# Altium schematic sheet CM4_MotherBoard.SchDoc
size A0
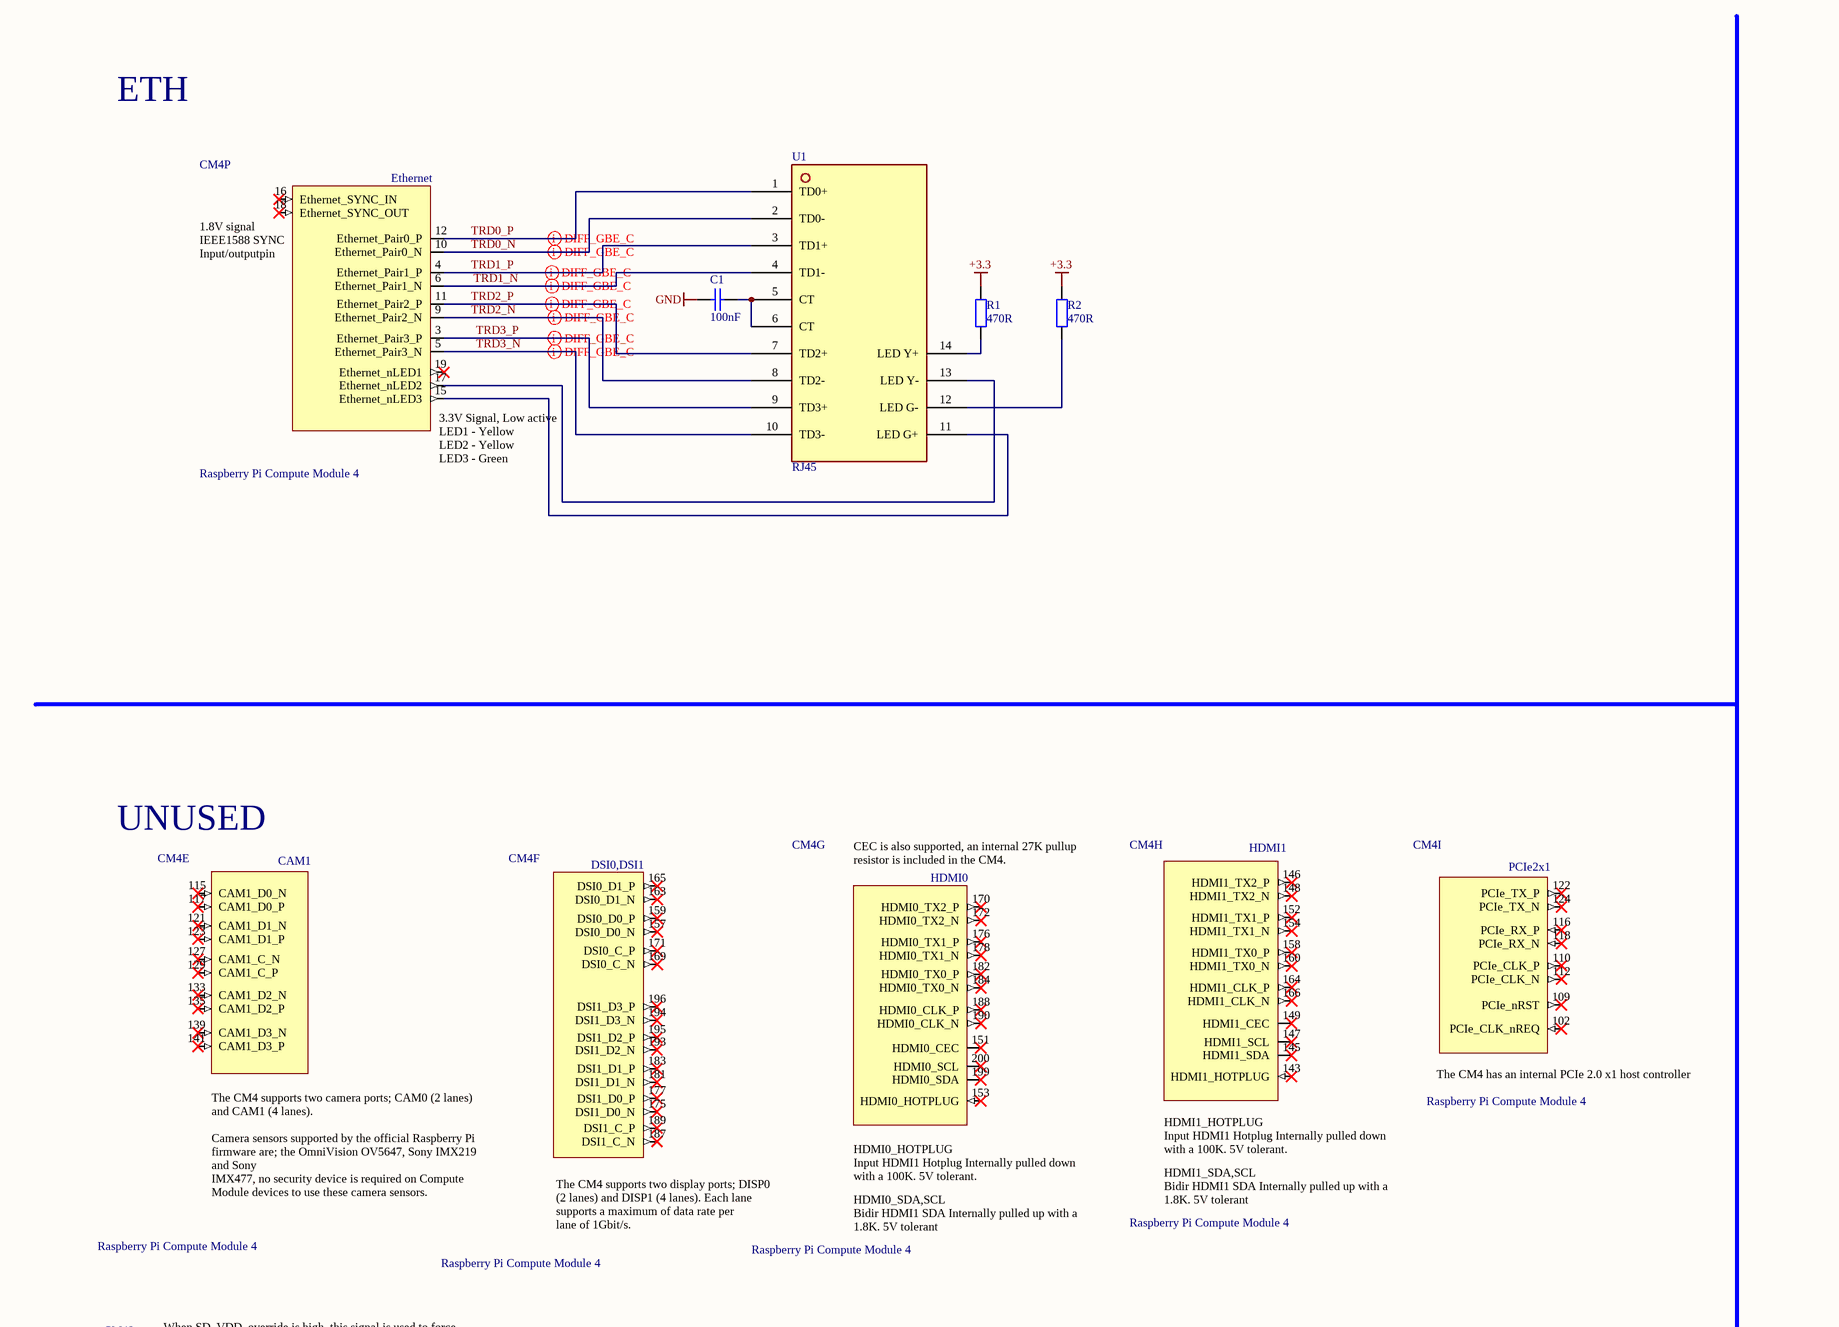
[diagram p0: CM4_MotherBoard.SchDoc, top left]
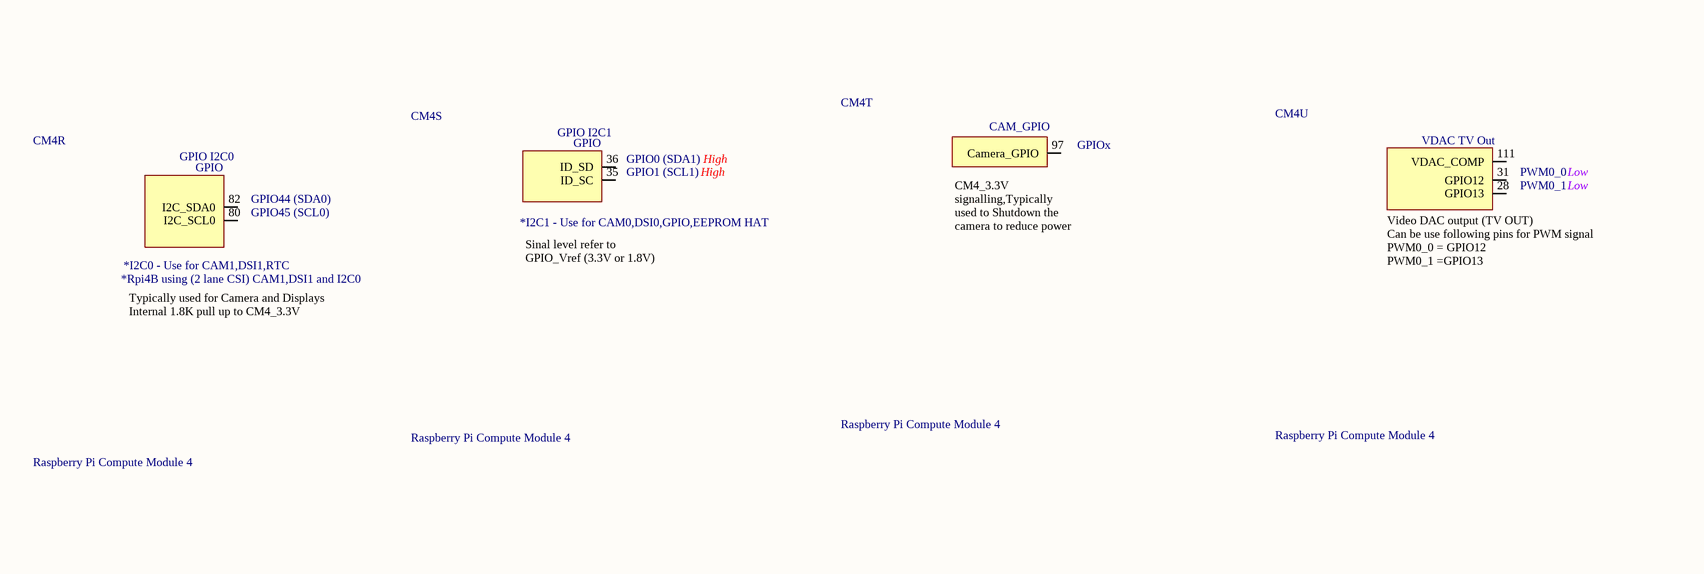
[diagram p1: CM4_MotherBoard.SchDoc, top middle]
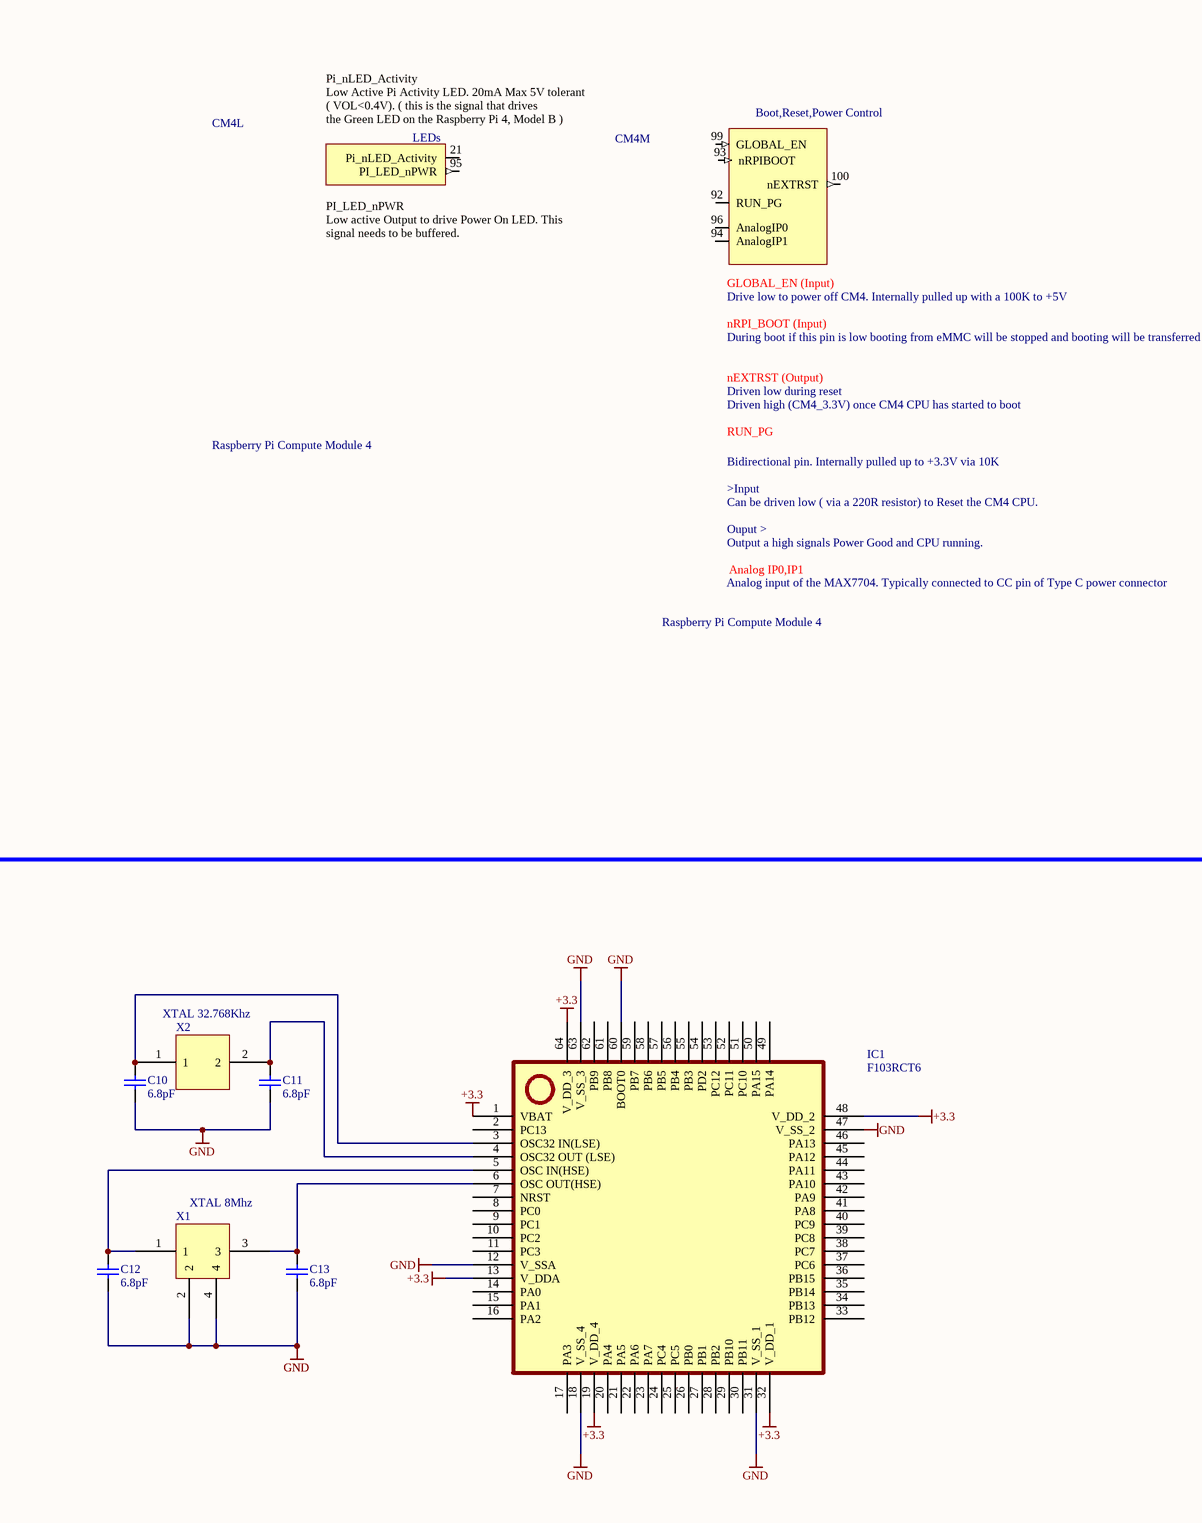
[diagram p2: CM4_MotherBoard.SchDoc, top right]
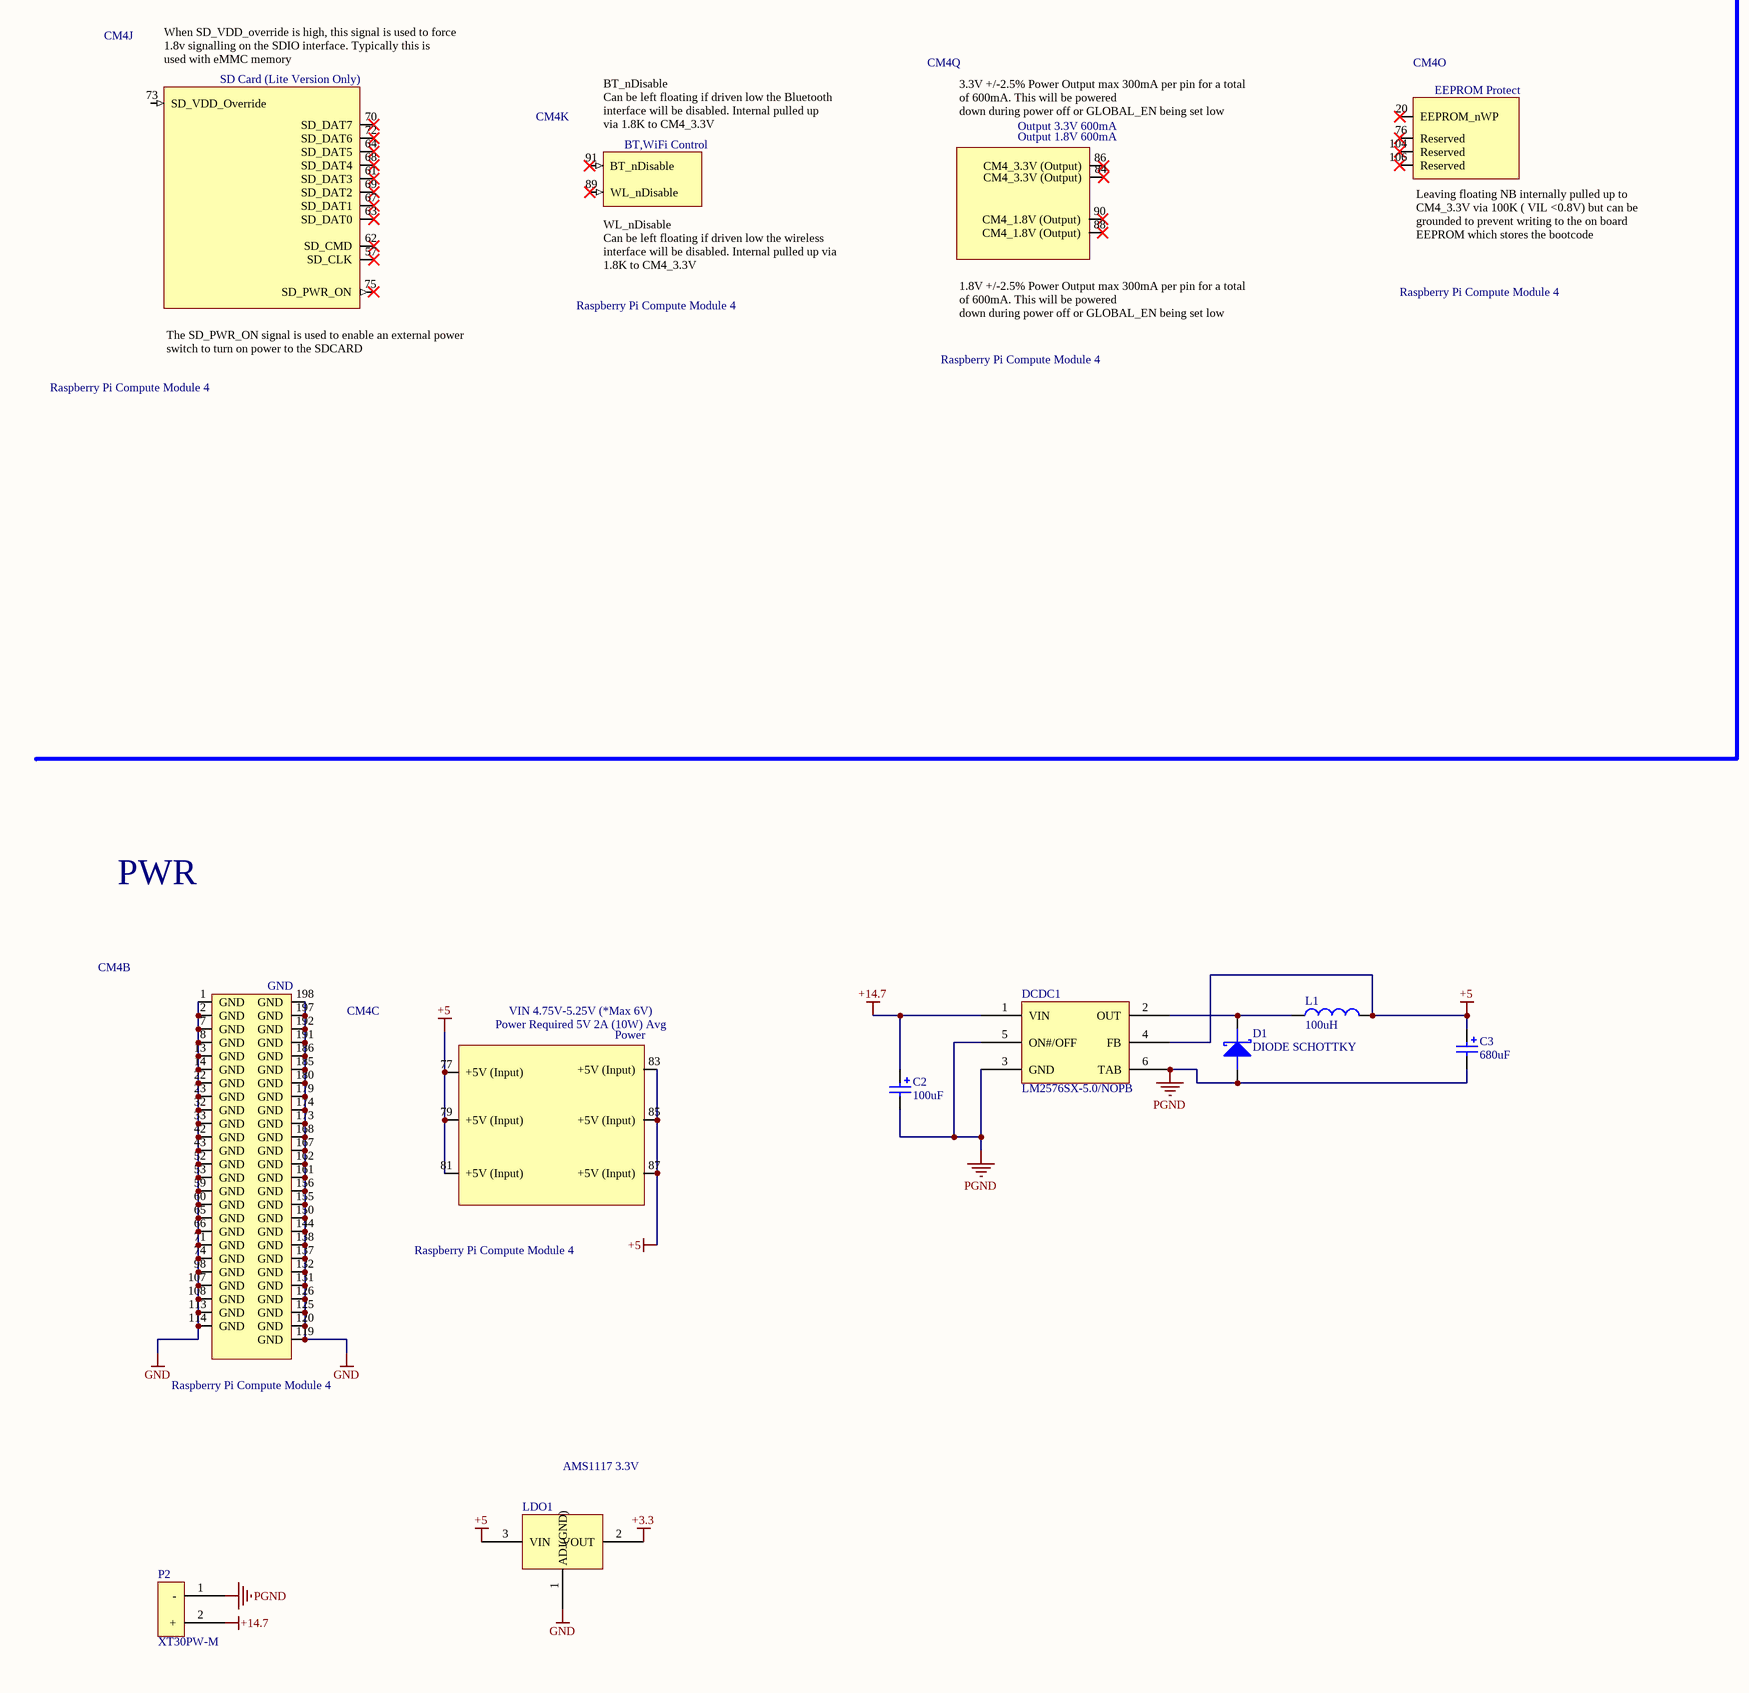
[diagram p3: CM4_MotherBoard.SchDoc, bottom left]
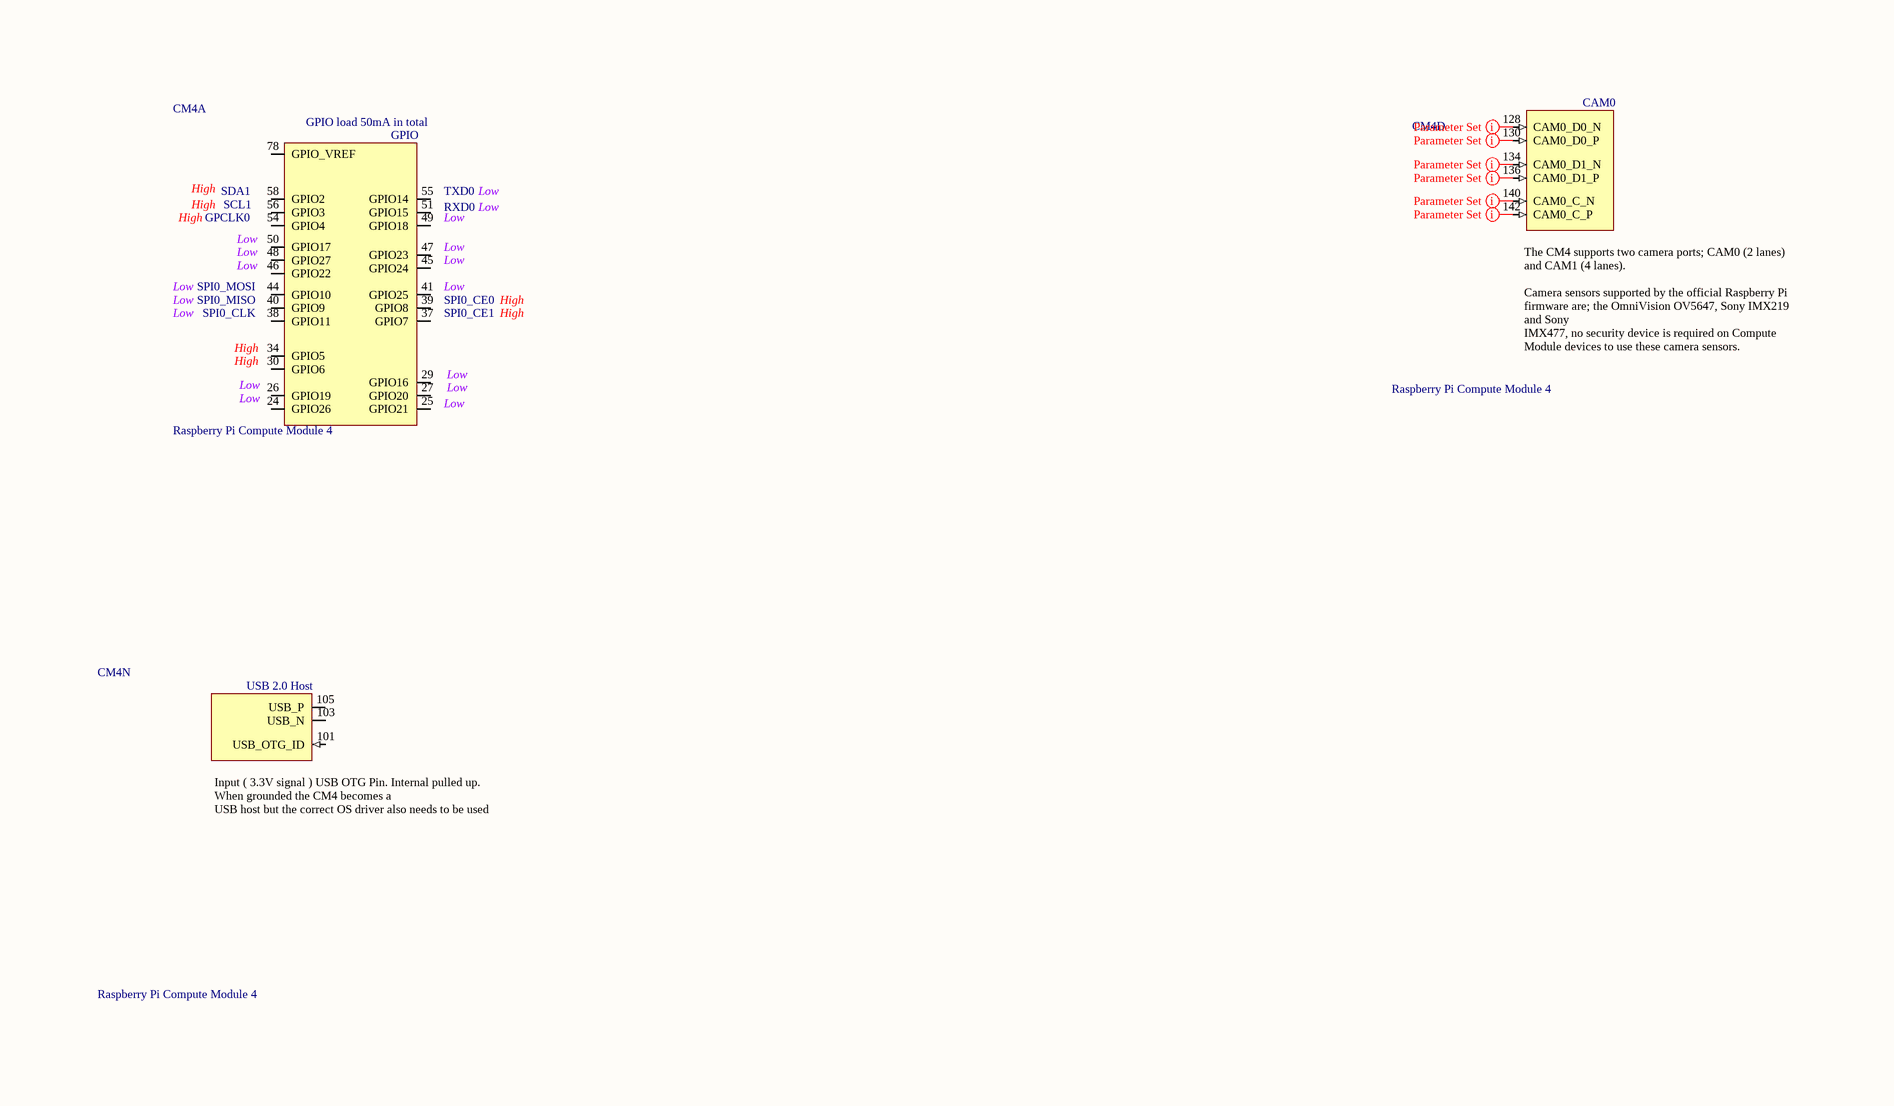
[diagram p4: CM4_MotherBoard.SchDoc, bottom middle]
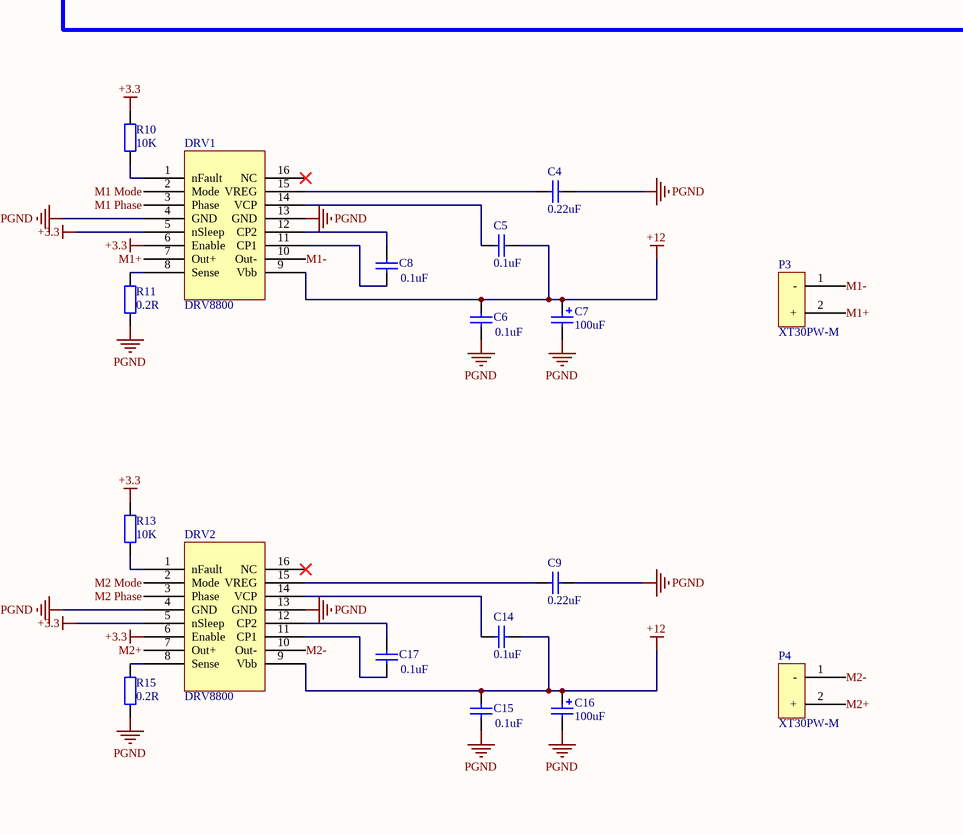
[diagram p5: CM4_MotherBoard.SchDoc, bottom right]

## Parts
C1  100nF  [0805]
C2  100uF  [Cap Pol 100uF]
C3  680uF  [Cap Pol 680uF]
C4  0.22uF  [0805]
C5  0.1uF  [0805]
C6  0.1uF  [0805]
C7  100uF  [Cap Pol 680uF]
C8  0.1uF  [0805]
C9  0.22uF  [0805]
C10  6.8pF  [0805]
C11  6.8pF  [0805]
C12  6.8pF  [0805]
C13  6.8pF  [0805]
C14  0.1uF  [0805]
C15  0.1uF  [0805]
C16  100uF  [Cap Pol 680uF]
C17  0.1uF  [0805]
CM4  Raspberry Pi Compute Module 4  [CM4-F40C-100DS-0.4v_1.5mm_0mm]  (parts A,B,C,D,E,F,G,H,I,J,K,L,M,N,O,P,Q,R,S,T,U of 21)
D1  DIODE SCHOTTKY  [Schottky]
DCDC1  LM2576SX-5.0/NOPB  [LM2576SX-5.0/NOPB]
DRV1  DRV8800  [DRV8800]
DRV2  DRV8800  [DRV8800]
IC1  F103RCT6  [F103]
L1  100uH  [Inductor 100uH]
LDO1  AMS1117 3.3V  [AMS117]
P2  XT30PW-M  [XT30PW-M]
P3  XT30PW-M  [XT30PW-M]
P4  XT30PW-M  [XT30PW-M]
R1  470R  [0805]
R2  470R  [0805]
R10  10K  [0805]
R11  0.2R  [0805]
R13  10K  [0805]
R15  0.2R  [0805]
U1  RJ45  [RJ45]
X1  XTAL 8Mhz  [XTAL 8Mhz]
X2  XTAL 32.768Khz  [XTAL 32.768Khz]

## Nets
+3.3: DRV1.5(nSleep) DRV1.6(Enable) DRV2.5(nSleep) DRV2.6(Enable) IC1.1(VBAT) IC1.13(V_DDA) IC1.19(V_DD_4) IC1.32(V_DD_1) IC1.48(V_DD_2) IC1.64(V_DD_3) LDO1.2(VOUT) R1.2 R2.2 R10.2 R13.2
+5: C3.1 CM4.77(+5V_(Input)) CM4.79(+5V_(Input)) CM4.81(+5V_(Input)) CM4.83(+5V_(Input)) CM4.85(+5V_(Input)) CM4.87(+5V_(Input)) DCDC1.4(FB) L1.2 LDO1.3(VIN)
+12: C5.2 C6.2 C7.1 C14.2 C15.2 C16.1 DRV1.9(Vbb) DRV2.9(Vbb)
+14.7: C2.1 DCDC1.1(VIN) P2.2(+)
GND: C1.1 C10.1 C11.1 C12.1 C13.1 CM4.1(GND) CM4.2(GND) CM4.7(GND) CM4.8(GND) CM4.13(GND) CM4.14(GND) CM4.22(GND) CM4.23(GND) CM4.32(GND) CM4.33(GND) CM4.42(GND) CM4.43(GND) CM4.52(GND) CM4.53(GND) CM4.59(GND) CM4.60(GND) CM4.65(GND) CM4.66(GND) CM4.71(GND) CM4.74(GND) CM4.98(GND) CM4.107(GND) CM4.108(GND) CM4.113(GND) CM4.114(GND) CM4.119(GND) CM4.120(GND) CM4.125(GND) CM4.126(GND) CM4.131(GND) CM4.132(GND) CM4.137(GND) CM4.138(GND) CM4.144(GND) CM4.150(GND) CM4.155(GND) CM4.156(GND) CM4.161(GND) CM4.162(GND) CM4.167(GND) CM4.168(GND) CM4.173(GND) CM4.174(GND) CM4.179(GND) CM4.180(GND) CM4.185(GND) CM4.186(GND) CM4.191(GND) CM4.192(GND) CM4.197(GND) CM4.198(GND) IC1.12(V_SSA) IC1.18(V_SS_4) IC1.31(V_SS_1) IC1.47(V_SS_2) IC1.60(BOOT0) IC1.63(V_SS_3) LDO1.1(ADJ(GND)) X1.2 X1.4
PGND: C2.2 C3.2 C4.2 C6.1 C7.2 C9.2 C15.1 C16.2 D1.1 DCDC1.3(GND) DCDC1.5(ON#/OFF) DCDC1.6(TAB) DRV1.4(GND) DRV1.13(GND) DRV2.4(GND) DRV2.13(GND) P2.1(-) R11.1 R15.1
M1 Mode: DRV1.2(Mode)
M1 Phase: DRV1.3(Phase)
M1+: DRV1.7(Out+) P3.2(+)
M1-: DRV1.10(Out-) P3.1(-)
M2 Mode: DRV2.2(Mode)
M2 Phase: DRV2.3(Phase)
M2+: DRV2.7(Out+) P4.2(+)
M2-: DRV2.10(Out-) P4.1(-)
TRD0_N: CM4.10(Ethernet_Pair0_N) U1.2(TD0-)
TRD0_P: CM4.12(Ethernet_Pair0_P) U1.1(TD0+)
TRD1_N: CM4.6(Ethernet_Pair1_N) U1.4(TD1-)
TRD1_P: CM4.4(Ethernet_Pair1_P) U1.3(TD1+)
TRD2_N: CM4.9(Ethernet_Pair2_N) U1.8(TD2-)
TRD2_P: CM4.11(Ethernet_Pair2_P) U1.7(TD2+)
TRD3_N: CM4.5(Ethernet_Pair3_N) U1.10(TD3-)
TRD3_P: CM4.3(Ethernet_Pair3_P) U1.9(TD3+)
NetC1_2: C1.2 U1.5(CT) U1.6(CT)
NetC4_1: C4.1 DRV1.15(VREG)
NetC5_1: C5.1 DRV1.14(VCP)
NetC8_1: C8.1 DRV1.11(CP1)
NetC8_2: C8.2 DRV1.12(CP2)
NetC9_1: C9.1 DRV2.15(VREG)
NetC10_2: C10.2 IC1.3(OSC32_IN(LSE)) X2.1
NetC11_2: C11.2 IC1.4(OSC32_OUT_(LSE)) X2.2
NetC12_2: C12.2 IC1.5(OSC_IN(HSE)) X1.1
NetC13_2: C13.2 IC1.6(OSC_OUT(HSE)) X1.3
NetC14_1: C14.1 DRV2.14(VCP)
NetC17_1: C17.1 DRV2.11(CP1)
NetC17_2: C17.2 DRV2.12(CP2)
NetCM4_15: CM4.15(Ethernet_nLED3) U1.11(LED_G+)
NetCM4_17: CM4.17(Ethernet_nLED2) U1.13(LED_Y-)
NetD1_2: D1.2 DCDC1.2(OUT) L1.1
NetDRV1_1: DRV1.1(nFault) R10.1
NetDRV1_8: DRV1.8(Sense) R11.2
NetDRV2_1: DRV2.1(nFault) R13.1
NetDRV2_8: DRV2.8(Sense) R15.2
NetR1_1: R1.1 U1.14(LED_Y+)
NetR2_1: R2.1 U1.12(LED_G-)

Not connected (* = marked no-connect by the designer): CM4 16(Ethernet_SYNC_IN)* 18(Ethernet_SYNC_OUT)* 19(Ethernet_nLED1)* 20(EEPROM_nWP)* 21(Pi_nLED_Activity) 24(GPIO26) 25(GPIO21) 26(GPIO19) 27(GPIO20) 28(GPIO13) 29(GPIO16) 30(GPIO6) 31(GPIO12) 34(GPIO5) 35(ID_SC) 36(ID_SD) 37(GPIO7) 38(GPIO11) 39(GPIO8) 40(GPIO9) 41(GPIO25) 44(GPIO10) 45(GPIO24) 46(GPIO22) 47(GPIO23) 48(GPIO27) 49(GPIO18) 50(GPIO17) 51(GPIO15) 54(GPIO4) 55(GPIO14) 56(GPIO3) 57(SD_CLK)* 58(GPIO2) 61(SD_DAT3)* 62(SD_CMD)* 63(SD_DAT0)* 64(SD_DAT5)* 67(SD_DAT1)* 68(SD_DAT4)* 69(SD_DAT2)* 70(SD_DAT7)* 72(SD_DAT6)* 73(SD_VDD_Override) 75(SD_PWR_ON)* 76(Reserved)* 78(GPIO_VREF) 80(I2C_SCL0) 82(I2C_SDA0) 84(CM4_3.3V_(Output))* 86(CM4_3.3V_(Output))* 88(CM4_1.8V_(Output))* 89(WL_nDisable)* 90(CM4_1.8V_(Output))* 91(BT_nDisable)* 92(RUN_PG) 93(nRPIBOOT) 94(AnalogIP1) 95(PI_LED_nPWR) 96(AnalogIP0) 97(Camera_GPIO) 99(GLOBAL_EN) 100(nEXTRST) 101(USB_OTG_ID) 102(PCIe_CLK_nREQ)* 103(USB_N) 104(Reserved)* 105(USB_P) 106(Reserved)* 109(PCIe_nRST)* 110(PCIe_CLK_P)* 111(VDAC_COMP) 112(PCIe_CLK_N)* 115(CAM1_D0_N)* 116(PCIe_RX_P)* 117(CAM1_D0_P)* 118(PCIe_RX_N)* 121(CAM1_D1_N)* 122(PCIe_TX_P)* 123(CAM1_D1_P)* 124(PCIe_TX_N)* 127(CAM1_C_N)* 128(CAM0_D0_N) 129(CAM1_C_P)* 130(CAM0_D0_P) 133(CAM1_D2_N)* 134(CAM0_D1_N) 135(CAM1_D2_P)* 136(CAM0_D1_P) 139(CAM1_D3_N)* 140(CAM0_C_N) 141(CAM1_D3_P)* 142(CAM0_C_P) 143(HDMI1_HOTPLUG)* 145(HDMI1_SDA)* 146(HDMI1_TX2_P)* 147(HDMI1_SCL)* 148(HDMI1_TX2_N)* 149(HDMI1_CEC)* 151(HDMI0_CEC)* 152(HDMI1_TX1_P)* 153(HDMI0_HOTPLUG)* 154(HDMI1_TX1_N)* 157(DSI0_D0_N)* 158(HDMI1_TX0_P)* 159(DSI0_D0_P)* 160(HDMI1_TX0_N)* 163(DSI0_D1_N)* 164(HDMI1_CLK_P)* 165(DSI0_D1_P)* 166(HDMI1_CLK_N)* 169(DSI0_C_N)* 170(HDMI0_TX2_P)* 171(DSI0_C_P)* 172(HDMI0_TX2_N)* 175(DSI1_D0_N)* 176(HDMI0_TX1_P)* 177(DSI1_D0_P)* 178(HDMI0_TX1_N)* 181(DSI1_D1_N)* 182(HDMI0_TX0_P)* 183(DSI1_D1_P)* 184(HDMI0_TX0_N)* 187(DSI1_C_N)* 188(HDMI0_CLK_P)* 189(DSI1_C_P)* 190(HDMI0_CLK_N)* 193(DSI1_D2_N)* 194(DSI1_D3_N)* 195(DSI1_D2_P)* 196(DSI1_D3_P)* 199(HDMI0_SDA)* 200(HDMI0_SCL)*; DRV1 16(NC)*; DRV2 16(NC)*; IC1 2(PC13) 7(NRST) 8(PC0) 9(PC1) 10(PC2) 11(PC3) 14(PA0) 15(PA1) 16(PA2) 17(PA3) 20(PA4) 21(PA5) 22(PA6) 23(PA7) 24(PC4) 25(PC5) 26(PB0) 27(PB1) 28(PB2) 29(PB10) 30(PB11) 33(PB12) 34(PB13) 35(PB14) 36(PB15) 37(PC6) 38(PC7) 39(PC8) 40(PC9) 41(PA8) 42(PA9) 43(PA10) 44(PA11) 45(PA12) 46(PA13) 49(PA14) 50(PA15) 51(PC10) 52(PC11) 53(PC12) 54(PD2) 55(PB3) 56(PB4) 57(PB5) 58(PB6) 59(PB7) 61(PB8) 62(PB9)

## Layout directives
differential pair; differential pair class DIFF_100Ohm_GBE; differential pair class DIFF_LAN_GB; net class GBE_1Gbps: TRD0_N, TRD0_P, TRD1_N, TRD1_P, TRD2_N, TRD2_P, TRD3_N, TRD3_P

## Notes on the sheet
- ETH
- UNUSED
- PWR
- (in symbol CM4, part A) GPIO load 50mA in total; GPIO; High; SDA1; TXD0; Low; SCL1; RXD0; GPCLK0; SPI0_MOSI; SPI0_MISO; SPI0_CE0; SPI0_CLK; SPI0_CE1; by Amornthep Phunsin
- (in symbol CM4, part C) VIN 4.75V-5.25V (*Max 6V); Power Required 5V 2A (10W) Avg; Power; by Amornthep Phunsin
- (in symbol CM4, part D) CAM0; The CM4 supports two camera ports; CAM0 (2 lanes) and CAM1 (4 lanes). / Camera sensors supported by the official Raspberry Pi firmware are; the OmniVision OV5647, Sony IMX219 and Sony / IMX477, no security device is required on Compute Module devices to use these camera sensors.
- (in symbol CM4, part E) CAM1; The CM4 supports two camera ports; CAM0 (2 lanes) and CAM1 (4 lanes). / Camera sensors supported by the official Raspberry Pi firmware are; the OmniVision OV5647, Sony IMX219 and Sony / IMX477, no security device is required on Compute Module devices to use these camera sensors.
- (in symbol CM4, part F) DSI0,DSI1; The CM4 supports two display ports; DISP0 (2 lanes) and DISP1 (4 lanes). Each lane supports a maximum of data rate per / lane of 1Gbit/s.
- (in symbol CM4, part G) HDMI0; CEC is also supported, an internal 27K pullup resistor is included in the CM4.; HDMI0_HOTPLUG / Input HDMI1 Hotplug Internally pulled down with a 100K. 5V tolerant.; HDMI0_SDA,SCL / Bidir HDMI1 SDA Internally pulled up with a 1.8K. 5V tolerant
- (in symbol CM4, part H) HDMI1; HDMI1_HOTPLUG / Input HDMI1 Hotplug Internally pulled down with a 100K. 5V tolerant.; HDMI1_SDA,SCL / Bidir HDMI1 SDA Internally pulled up with a 1.8K. 5V tolerant
- (in symbol CM4, part I) PCIe2x1; The CM4 has an internal PCIe 2.0 x1 host controller
- (in symbol CM4, part J) When SD_VDD_override is high, this signal is used to force 1.8v signalling on the SDIO interface. Typically this is / used with eMMC memory; SD Card (Lite Version Only); by Amornthep Phunsin; The SD_PWR_ON signal is used to enable an external power switch to turn on power to the SDCARD
- (in symbol CM4, part K) BT_nDisable / Can be left floating if driven low the Bluetooth interface will be disabled. Internal pulled up / via 1.8K to CM4_3.3V; BT,WiFi Control; WL_nDisable / Can be left floating if driven low the wireless interface will be disabled. Internal pulled up via / 1.8K to CM4_3.3V
- (in symbol CM4, part L) Pi_nLED_Activity / Low Active Pi Activity LED. 20mA Max 5V tolerant ( VOL<0.4V). ( this is the signal that drives / the Green LED on the Raspberry Pi 4, Model B ); LEDs; PI_LED_nPWR / Low active Output to drive Power On LED. This signal needs to be buffered.
- (in symbol CM4, part M) Boot,Reset,Power Control; GLOBAL_EN (Input); Drive low to power off CM4. Internally pulled up with a 100K to +5V; nRPI_BOOT (Input); During boot if this pin is low booting from eMMC will be stopped and booting will be transferred to rpi boot which is via; nEXTRST (Output); Driven low during reset; Driven high (CM4_3.3V) once CM4 CPU has started to boot; Bidirectional pin. Internally pulled up to +3.3V via 10K / >Input / Can be driven low ( via a 220R resistor) to Reset the CM4 CPU. / Ouput > / Output a high signals Power Good and CPU running.; Analog IP0,IP1; Analog input of the MAX7704. Typically connected to CC pin of Type C power connector
- (in symbol CM4, part N) USB 2.0 Host; Input ( 3.3V signal ) USB OTG Pin. Internal pulled up. When grounded the CM4 becomes a / USB host but the correct OS driver also needs to be used
- (in symbol CM4, part O) EEPROM Protect; Leaving floating NB internally pulled up to CM4_3.3V via 100K ( VIL <0.8V) but can be / grounded to prevent writing to the on board EEPROM which stores the bootcode
- (in symbol CM4, part P) Ethernet; 1.8V signal / IEEE1588 SYNC Input/outputpin; 3.3V Signal, Low active / LED1 - Yellow / LED2 - Yellow / LED3 - Green
- (in symbol CM4, part Q) 3.3V +/-2.5% Power Output max 300mA per pin for a total of 600mA. This will be powered / down during power off or GLOBAL_EN being set low; Output 3.3V 600mA; Output 1.8V 600mA; 1.8V +/-2.5% Power Output max 300mA per pin for a total of 600mA. This will be powered / down during power off or GLOBAL_EN being set low
- (in symbol CM4, part R) GPIO I2C0; GPIO; GPIO44 (SDA0); GPIO45 (SCL0); *I2C0 - Use for CAM1,DSI1,RTC; *Rpi4B using (2 lane CSI) CAM1,DSI1 and I2C0; Typically used for Camera and Displays Internal 1.8K pull up to CM4_3.3V
- (in symbol CM4, part S) GPIO I2C1; GPIO; GPIO0 (SDA1); High; GPIO1 (SCL1); *I2C1 - Use for CAM0,DSI0,GPIO,EEPROM HAT; Sinal level refer to  GPIO_Vref (3.3V or 1.8V)
- (in symbol CM4, part T) CAM_GPIO; GPIOx; CM4_3.3V signalling,Typically used to Shutdown the camera to reduce power
- (in symbol CM4, part U) VDAC TV Out; PWM0_0; Low; PWM0_1; Video DAC output (TV OUT) / Can be use following pins for PWM signal / PWM0_0 = GPIO12 / PWM0_1 =GPIO13

## Library data of the parts
C1 C4-C6 C8-C15 C17 = Cap: Capacitor; Published: 8-Jun-2000; LatestRevisionDate: 17-Jul-2002; LatestRevisionNote: Re-released for DXP Platform.; PackageReference: RAD-0.3; Publisher: Altium Limited; PackageDescription: Radial Cap, Thru-Hole; 2 Leads; 0.3 in Pin Spacing
C2 C3 C7 C16 = Cap Pol: Polarized Capacitor (Radial); Published: 8-Jun-2000; LatestRevisionDate: 17-Jul-2002; LatestRevisionNote: Re-released for DXP Platform.; PackageReference: RB7.6-15; Publisher: Altium Limited; PackageDescription: Polarized Capacitor (Radial); 2 Leads
CM4 = CM4: Raspberry Pi Compute Module 4 by Amornthep Phunsin
D1 = DIODE SCHOTTKY: 肖特基二极管
IC1 = F103RCT6: STM32F103RCT6 LQFP64
L1 = Inductor: Code_IEC: 1005; Published: 8-Jun-2000; LatestRevisionDate: 29-May-2009; LatestRevisionNote: IPC-7351 Footprint Added.; PackageReference: 0402-A; Publisher: Altium Limited; PackageDescription: Chip Inductor; Code_JEITA: 0402
R1 R2 R10 R11 R13 R15 = Res: Resistor; Published: 8-Jun-2000; LatestRevisionDate: 17-Jul-2002; LatestRevisionNote: Re-released for DXP Platform.; PackageReference: AXIAL-0.4; Publisher: Altium Limited; PackageDescription: Axial Device, Thru-Hole; 2 Leads; 0.4 in Pin Spacing
U1 = RJ45: 48F-01GY2DPL2NL
X1 = XTAL 8Mhz: 8Mhz XTAL  SMD3225-4P
X2 = XTAL 32.768Khz: 32.768Khz XTAL  SMD3215-2P